# Altium schematic sheet ProbadorDeCables_Conexiones_A.SchDoc
size A4
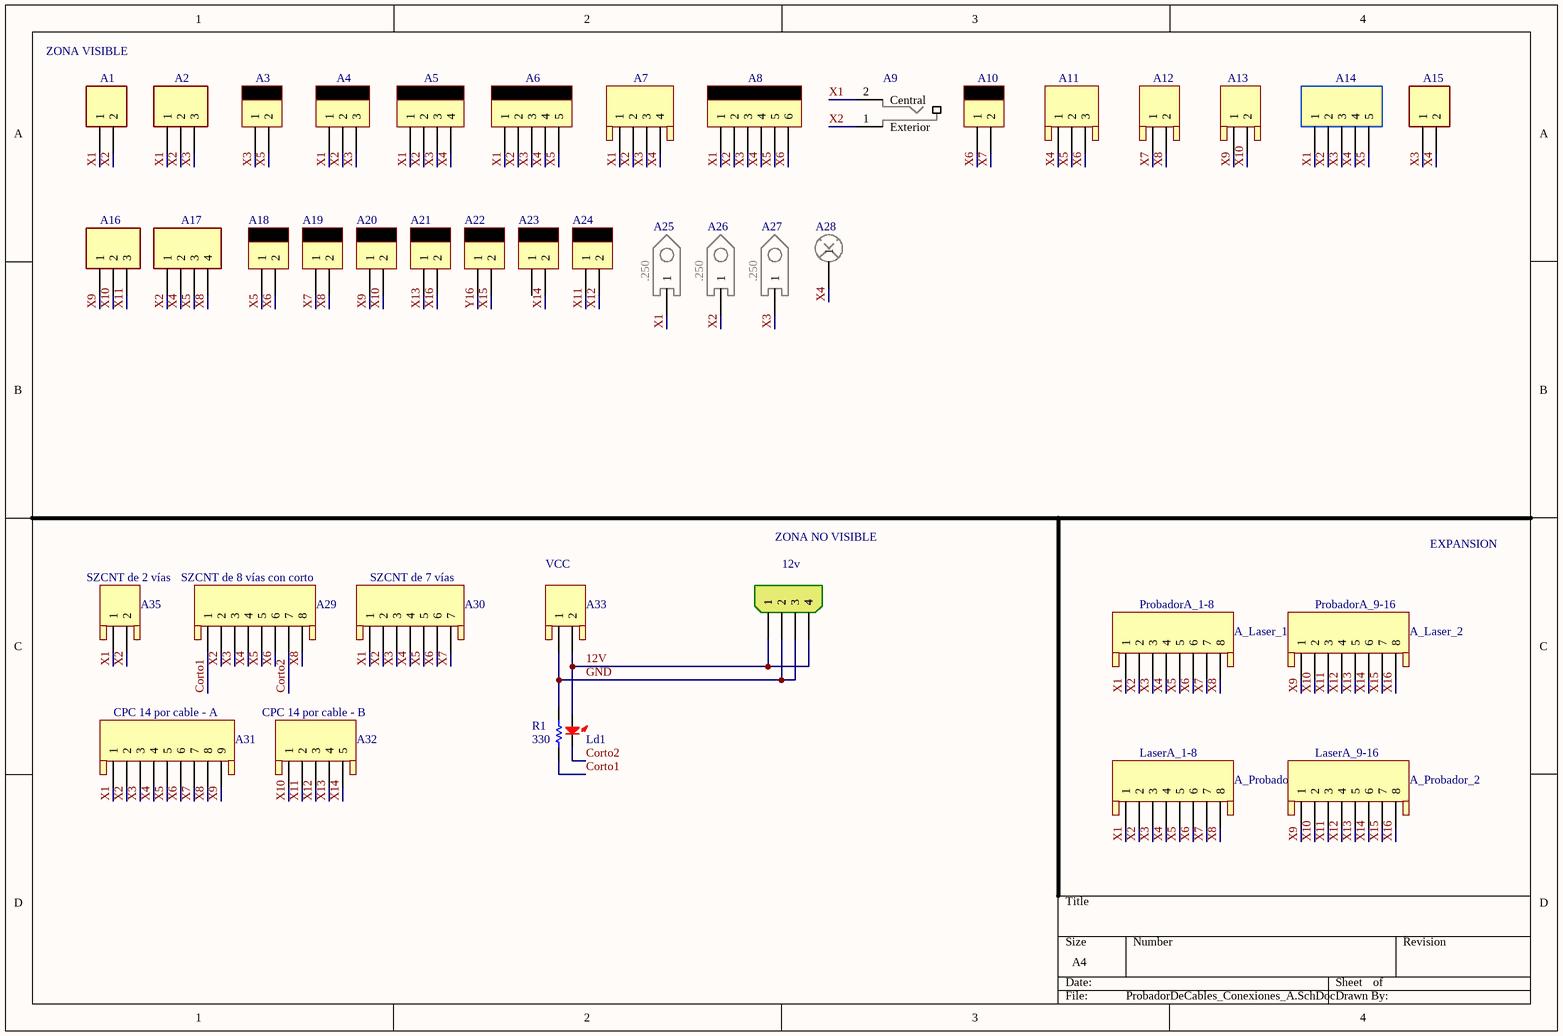
[diagram p0: ProbadorDeCables_Conexiones_A.SchDoc]

## Parts
12v  MAZ 103 y 104  [794285-1]  (value not drawn)
A1  JST_2.5_2  [B2B-XH-A]  (value not drawn)
A2  JST_2.5_3  [B3B-XH-A]  (value not drawn)
A3  Para_SL-156__640445-2  [640445-2]  (value not drawn)
A4  Para_SL-156__640445-3  [640445-3]  (value not drawn)
A5  Para_SL-156__640445-4  [640445-4]  (value not drawn)
A6  Para_SL-156__640445-5  [640445-5]  (value not drawn)
A7  Para_CST_100__640456-4  [640456-4]  (value not drawn)
A8  Para_SL-156__640445-6  [640445-6]  (value not drawn)
A9  RCA mono para placa - Negro  [RCJ-021]  (value not drawn)
A10  Para_SL-156__640445-2  [640445-2]  (value not drawn)
A11  Para_CST_100__640456-3  [640456-3]  (value not drawn)
A12  Para_CST_100__640456-2  [640456-2]  (value not drawn)
A13  Para_CST_100__640456-2  [640456-2]  (value not drawn)
A14  USB 2_0 micro B  [USB2.0_MicroB]  (value not drawn)
A15  JST_2.5_2  [B2B-XH-A]  (value not drawn)
A16  JST_2.5_3  [B3B-XH-A]  (value not drawn)
A17  JST_2.5_4  [B4B-XH-A]  (value not drawn)
A18  Para_SL-156__640445-2  [640445-2]  (value not drawn)
A19  Para_SL-156__640445-2  [640445-2]  (value not drawn)
A20  Para_SL-156__640445-2  [640445-2]  (value not drawn)
A21  Para_SL-156__640445-2  [640445-2]  (value not drawn)
A22  Para_SL-156__640445-2  [640445-2]  (value not drawn)
A23  Para_SL-156__640445-2  [640445-2]  (value not drawn)
A24  Para_SL-156__640445-2  [640445-2]  (value not drawn)
A25  Pala macho 6.3 para placa  [Pala macho 6.3 para placa]  (value not drawn)
A26  Pala macho 6.3 para placa  [Pala macho 6.3 para placa]  (value not drawn)
A27  Pala macho 6.3 para placa  [Pala macho 6.3 para placa]  (value not drawn)
A28  SCREW M4 4 PIN PCB  [SCREW M4 4 PIN PCB]  (value not drawn)
A29  SZCNT de 8 vías con corto  [640456-8]
A30  SZCNT de 7 vías  [640456-7]
A31  CPC 14 por cable - A  [640456-9]
A32  CPC 14 por cable - B  [640456-5]
A33  VCC  [640456-2]
A35  SZCNT de 2 vías  [640456-2]
A_Laser_1  ProbadorA_1-8  [640456-8]
A_Laser_2  ProbadorA_9-16  [640456-8]
A_Probador_1  LaserA_1-8  [640456-8]
A_Probador_2  LaserA_9-16  [640456-8]
Ld1  PinesParaLed  [Jumper-Simple]  (value not drawn)
R1  330  [R_0805]

## Nets
12V: 12v.1 12v.4 A33.2 Ld1.1
Corto1: A29.1 R1.1
Corto2: A29.7 Ld1.2
GND: 12v.2 12v.3 A33.1 R1.2
X1: A1.1 A2.1 A4.1 A5.1 A6.1 A7.1 A8.1 A9.2(Central) A14.1 A25.1 A30.1 A31.1 A35.1 A_Laser_1.1 A_Probador_1.1
X2: A1.2 A2.2 A4.2 A5.2 A6.2 A7.2 A8.2 A9.1(Exterior) A14.2 A17.1 A26.1 A29.2 A30.2 A31.2 A35.2 A_Laser_1.2 A_Probador_1.2
X3: A2.3 A3.1 A4.3 A5.3 A6.3 A7.3 A8.3 A14.3 A15.1 A27.1 A29.3 A30.3 A31.3 A_Laser_1.3 A_Probador_1.3
X4: A5.4 A6.4 A7.4 A8.4 A11.1 A14.4 A15.2 A17.2 A28.1 A29.4 A30.4 A31.4 A_Laser_1.4 A_Probador_1.4
X5: A3.2 A6.5 A8.5 A11.2 A14.5 A17.3 A18.1 A29.5 A30.5 A31.5 A_Laser_1.5 A_Probador_1.5
X6: A8.6 A10.1 A11.3 A18.2 A29.6 A30.6 A31.6 A_Laser_1.6 A_Probador_1.6
X7: A10.2 A12.1 A19.1 A30.7 A31.7 A_Laser_1.7 A_Probador_1.7
X8: A12.2 A17.4 A19.2 A29.8 A31.8 A_Laser_1.8 A_Probador_1.8
X9: A13.1 A16.1 A20.1 A31.9 A_Laser_2.1 A_Probador_2.1
X10: A13.2 A16.2 A20.2 A32.1 A_Laser_2.2 A_Probador_2.2
X11: A16.3 A24.1 A32.2 A_Laser_2.3 A_Probador_2.3
X12: A24.2 A32.3 A_Laser_2.4 A_Probador_2.4
X13: A21.1 A32.4 A_Laser_2.5 A_Probador_2.5
X14: A23.2 A32.5 A_Laser_2.6 A_Probador_2.6
X15: A22.2 A_Laser_2.7 A_Probador_2.7
X16: A21.2 A_Laser_2.8 A_Probador_2.8
Y16: A22.1

Not connected (* = marked no-connect by the designer): A23 1

## Notes on the sheet
- ZONA VISIBLE
- ZONA NO VISIBLE
- EXPANSION
- (in symbol Pala macho 6.3 para placa) .250

## Library data of the parts
12v = 794285-1: CONN HDR 4POS 0.2 TIN PCB; Fabricante: TE Connectivity AMP Connectors; Cod.Digikey: 794285-1-ND; Cod.Fabricante: 794285-1; DIGIKEYx100: 1.68330; ComponentLink2URL: https://www.te.com/commerce/DocumentDelivery/DDEController?Action=srchrtrv&DocNm=794285&DocType=Customer+Drawing&DocLang=English; ComponentLink2Description: Datasheet
A1 A15 = JST_2.5_2: CONN HEADER XH TOP 2POS 2.5MM; Cod.Fabricante: B2B-XH-A(LF)(SN); Fabricante: JST Sales America Inc.; LatestRevisionDate: 17-Jul-2002; LatestRevisionNote: Re-released for DXP Platform.; Publisher: Altium Limited; Cod.Digikey: 455-2247-ND; DIGIKEYx50: 0.08980; ComponentLink2URL: http://www.jst-mfg.com/product/pdf/eng/eXH.pdf; ComponentLink2Description: Datasheet
A2 A16 = JST_2.5_3: CONN HEADER XH TOP 3POS 2.5MM; Cod.Fabricante: B3B-XH-A(LF)(SN); Fabricante: JST Sales America Inc.; LatestRevisionDate: 17-Jul-2002; LatestRevisionNote: Re-released for DXP Platform.; Publisher: Altium Limited; Cod.Digikey: 455-2248-ND; ComponentLink2Description: Datasheet; ComponentLink2URL: http://www.jst-mfg.com/product/pdf/eng/eXH.pdf; DIGIKEYx50: 0.11540
A3 A10 A18-A24 = Para_SL-156__640445-2: CONN HEADER VERT 2POS .156 TIN; Fabricante: TE Connectivity AMP Connectors; Cod.Digikey: A1971-ND; Cod.Fabricante: 640445-2; DIGIKEYx100: 0.07960; ComponentLink2URL: https://www.te.com/commerce/DocumentDelivery/DDEController?Action=srchrtrv&DocNm=640445&DocType=Customer+Drawing&DocLang=English; ComponentLink2Description: Datasheet
A4 = Para_SL-156__640445-3: CONN HEADER VERT 3POS .156 TIN; Fabricante: TE Connectivity AMP Connectors; Cod.Digikey: A19890-ND; Cod.Fabricante: 640445-3; DIGIKEYx100: 0.13710; ComponentLink2URL: https://www.te.com/commerce/DocumentDelivery/DDEController?Action=srchrtrv&DocNm=640445&DocType=Customer+Drawing&DocLang=English; ComponentLink2Description: Datasheet
A5 = Para_SL-156__640445-4: CONN HEADER VERT 4POS .156 TIN; Fabricante: TE Connectivity AMP Connectors; Cod.Digikey: A1972-ND; Cod.Fabricante: 640445-4; DIGIKEYx100: 0.18210; ComponentLink2URL: https://www.te.com/commerce/DocumentDelivery/DDEController?Action=srchrtrv&DocNm=640445&DocType=Customer+Drawing&DocLang=English; ComponentLink2Description: Datasheet
A6 = Para_SL-156__640445-5: CONN HEADER VERT 5POS .156 TIN; Fabricante: TE Connectivity AMP Connectors; Cod.Digikey: A19891-ND; Cod.Fabricante: 640445-5; DIGIKEYx100: 0.23490; ComponentLink2URL: https://www.te.com/commerce/DocumentDelivery/DDEController?Action=srchrtrv&DocNm=640445&DocType=Customer+Drawing&DocLang=English; ComponentLink2Description: Datasheet
A7 = Para_CST_100__640456-4: CONN HEADER VERT 4POS .100 TIN; Cod.Fabricante: 640456-2; Fabricante: TE Connectivity AMP Connectors; LatestRevisionDate: 17-Jul-2002; LatestRevisionNote: Re-released for DXP Platform.; Publisher: Altium Limited; Cod.Digikey: A1922-ND; DIGIKEYx100: 0.14850; ComponentLink2URL: http://www.te.com/commerce/DocumentDelivery/DDEController?Action=srchrtrv&DocNm=640456&DocType=Customer+Drawing&DocLang=English; ComponentLink2Description: Datasheet
A8 = Para_SL-156__640445-6: CONN HEADER VERT 6POS .156 TIN; Fabricante: TE Connectivity AMP Connectors; Cod.Digikey: A1973-ND; Cod.Fabricante: 640445-6; DIGIKEYx100: 0.28780; ComponentLink2URL: https://www.te.com/commerce/DocumentDelivery/DDEController?Action=srchrtrv&DocNm=640445&DocType=Customer+Drawing&DocLang=English; ComponentLink2Description: Datasheet
A9 = RCA mono para placa - Negro: CONN RCA JACK MONO 3.2MM PCB; Fabricante: CUI Devices; Cod.Digikey: CP-1406-ND; Cod.Fabricante: RCJ-021; DIGIKEYx100: 0.66880; ComponentLink2URL: https://www.cuidevices.com/product/resource/digikeypdf/rcj-02x.pdf; ComponentLink2Description: Datasheet
A11 = Para_CST_100__640456-3: CONN HEADER VERT 3POS .100 TIN; Fabricante: TE Connectivity AMP Connectors; LatestRevisionDate: 17-Jul-2002; LatestRevisionNote: Re-released for DXP Platform.; Publisher: Altium Limited; Cod.Digikey: A19470-ND; Cod.Fabricante: 640456-3; DIGIKEYx100: 0.08910; ComponentLink2URL: http://www.te.com/commerce/DocumentDelivery/DDEController?Action=srchrtrv&DocNm=640456&DocType=Customer+Drawing&DocLang=English; ComponentLink2Description: Datasheet
A12 A13 A33 A35 = Para_CST_100__640456-2: CONN HEADER VERT 2POS .100 TIN; Fabricante: TE Connectivity AMP Connectors; LatestRevisionDate: 17-Jul-2002; LatestRevisionNote: Re-released for DXP Platform.; Publisher: Altium Limited; Cod.Digikey: A1921-ND; Cod.Fabricante: 640456-2; DIGIKEYx100: 0.06630; ComponentLink2URL: http://www.te.com/commerce/DocumentDelivery/DDEController?Action=srchrtrv&DocNm=640456&DocType=Customer+Drawing&DocLang=English; ComponentLink2Description: Datasheet
A14 = USB 2_0 micro B: CONN RCPT USB2.0 MICRO B SMD R/A; Cod.Fabricante: USB3160-30-0170-0-C; Fabricante: GCT; Cod.Digikey: 2073-USB3160-30-0170-0-CCT-ND; ComponentLink2Description: Datasheet; ComponentLink2URL: https://gct.co/files/drawings/usb3160.pdf; DIGIKEYx100: 0.57750
A17 = JST_2.5_4: CONN HEADER XH TOP 4POS 2.5MM; Cod.Fabricante: B4B-XH-A(LF)(SN); Fabricante: JST Sales America Inc.; LatestRevisionDate: 17-Jul-2002; LatestRevisionNote: Re-released for DXP Platform.; Publisher: Altium Limited; Cod.Digikey: 455-2249-ND; ComponentLink2Description: Datasheet; ComponentLink2URL: http://www.jst-mfg.com/product/pdf/eng/eXH.pdf; DIGIKEYx100: 0.13480
A25-A27 = Pala macho 6.3 para placa: CONN QC TAB 0.250 SOLDER; Cod.Fabricante: 1217125-1; Fabricante: TE Connectivity AMP Connectors; Cod.DigiKey: A110909CT-ND; ComponentLink1Description: Manufacturer Link; ComponentLink1URL: https://www.te.com/commerce/DocumentDelivery/DDEController?Action=srchrtrv&DocNm=1217125&DocType=Customer+Drawing&DocLang=English; DIGIKEYx100: 0.17180
A28 = SCREW M4 4 PIN PCB: TERM SCREW M4 4 PIN PCB; Cod.Fabricante: 7795; Fabricante: Keystone Electronics; Cod.Digikey: 36-7795-ND; DIGIKEYx100: 0.38960; ComponentLink2URL: http://keyelco.com/userAssets/file/M65p69.pdf; ComponentLink2Description: Datasheet
A29 A_Laser_1 A_Laser_2 A_Probador_1 A_Probador_2 = Para_CST_100__640456-8: CONN HEADER VERT 8POS .100 TIN; Fabricante: TE Connectivity AMP Connectors; Cod.Digikey: A1924-ND; Cod.Fabricante: 640456-8; DIGIKEYx100: 0.29070; ComponentLink2URL: http://www.te.com/commerce/DocumentDelivery/DDEController?Action=srchrtrv&DocNm=640456&DocType=Customer+Drawing&DocLang=English; ComponentLink2Description: Datasheet
  A29: LatestRevisionDate: 17-Jul-2002; LatestRevisionNote: Re-released for DXP Platform.; Publisher: Altium Limited
A30 = Para_CST_100__640456-7: CONN HEADER VERT 7POS .100 TIN; Fabricante: TE Connectivity AMP Connectors; LatestRevisionDate: 17-Jul-2002; LatestRevisionNote: Re-released for DXP Platform.; Publisher: Altium Limited; Cod.Digikey: A19472-ND; Cod.Fabricante: 640456-7; DIGIKEYx100: 0.27260; ComponentLink2URL: http://www.te.com/commerce/DocumentDelivery/DDEController?Action=srchrtrv&DocNm=640456&DocType=Customer+Drawing&DocLang=English; ComponentLink2Description: Datasheet
A31 = Para_CST_100__640456-9: CONN HEADER VERT 9POS .100 TIN; Fabricante: TE Connectivity AMP Connectors; LatestRevisionDate: 17-Jul-2002; LatestRevisionNote: Re-released for DXP Platform.; Publisher: Altium Limited; Cod.Digikey: A19473-ND; Cod.Fabricante: 640456-9; DIGIKEYx100: 0.41390; ComponentLink2URL: http://www.te.com/commerce/DocumentDelivery/DDEController?Action=srchrtrv&DocNm=640456&DocType=Customer+Drawing&DocLang=English; ComponentLink2Description: Datasheet
A32 = Para_CST_100__640456-5: CONN HEADER VERT 5POS .100 TIN; Fabricante: TE Connectivity AMP Connectors; LatestRevisionDate: 17-Jul-2002; LatestRevisionNote: Re-released for DXP Platform.; Publisher: Altium Limited; Cod.Digikey: A19471-ND; Cod.Fabricante: 640456-5; DIGIKEYx100: 0.20780; ComponentLink2URL: http://www.te.com/commerce/DocumentDelivery/DDEController?Action=srchrtrv&DocNm=640456&DocType=Customer+Drawing&DocLang=English; ComponentLink2Description: Datasheet
Ld1 = PinesParaLed: CONN HEADER 2 POS 2.54; Cod.Fabricante: 61300211121; Fabricante: Wurth Electronics Inc.; Cod.DigiKey: 732-5315-ND; ComponentLink1Description: Manufacturer Link; ComponentLink1URL: https://katalog.we-online.de/em/datasheet/6130xx11121.pdf; ComponentLink2Description: Datasheet; ComponentLink2URL: *; DatasheetVersion: *; DIGIKEYx100: 0.06700; LatestRevisionDate: *; LatestRevisionNote: *; PackageDescription: *; PackageReference: *; PackageVersion: *; Published: 29-sep-00; Publisher: Altium Limited; Value: *
R1 = R_330_0805: RES SMD 330 OHM 1% 1/8W 0805; Cod.Fabricante: RC0805FR-07330RL; Fabricante: Yageo; Published: 8-Jun-2000; LatestRevisionDate: 17-Jul-2002; LatestRevisionNote: Re-released for DXP Platform.; PackageReference: 0805; Publisher: Altium Limited; Cod.Digikey: 311-330CRCT-ND; Value: 330; DIGIKEYx100: 0.01630